# EAGLE schematic Goethe_RFID (EAGLE 7.7.0)
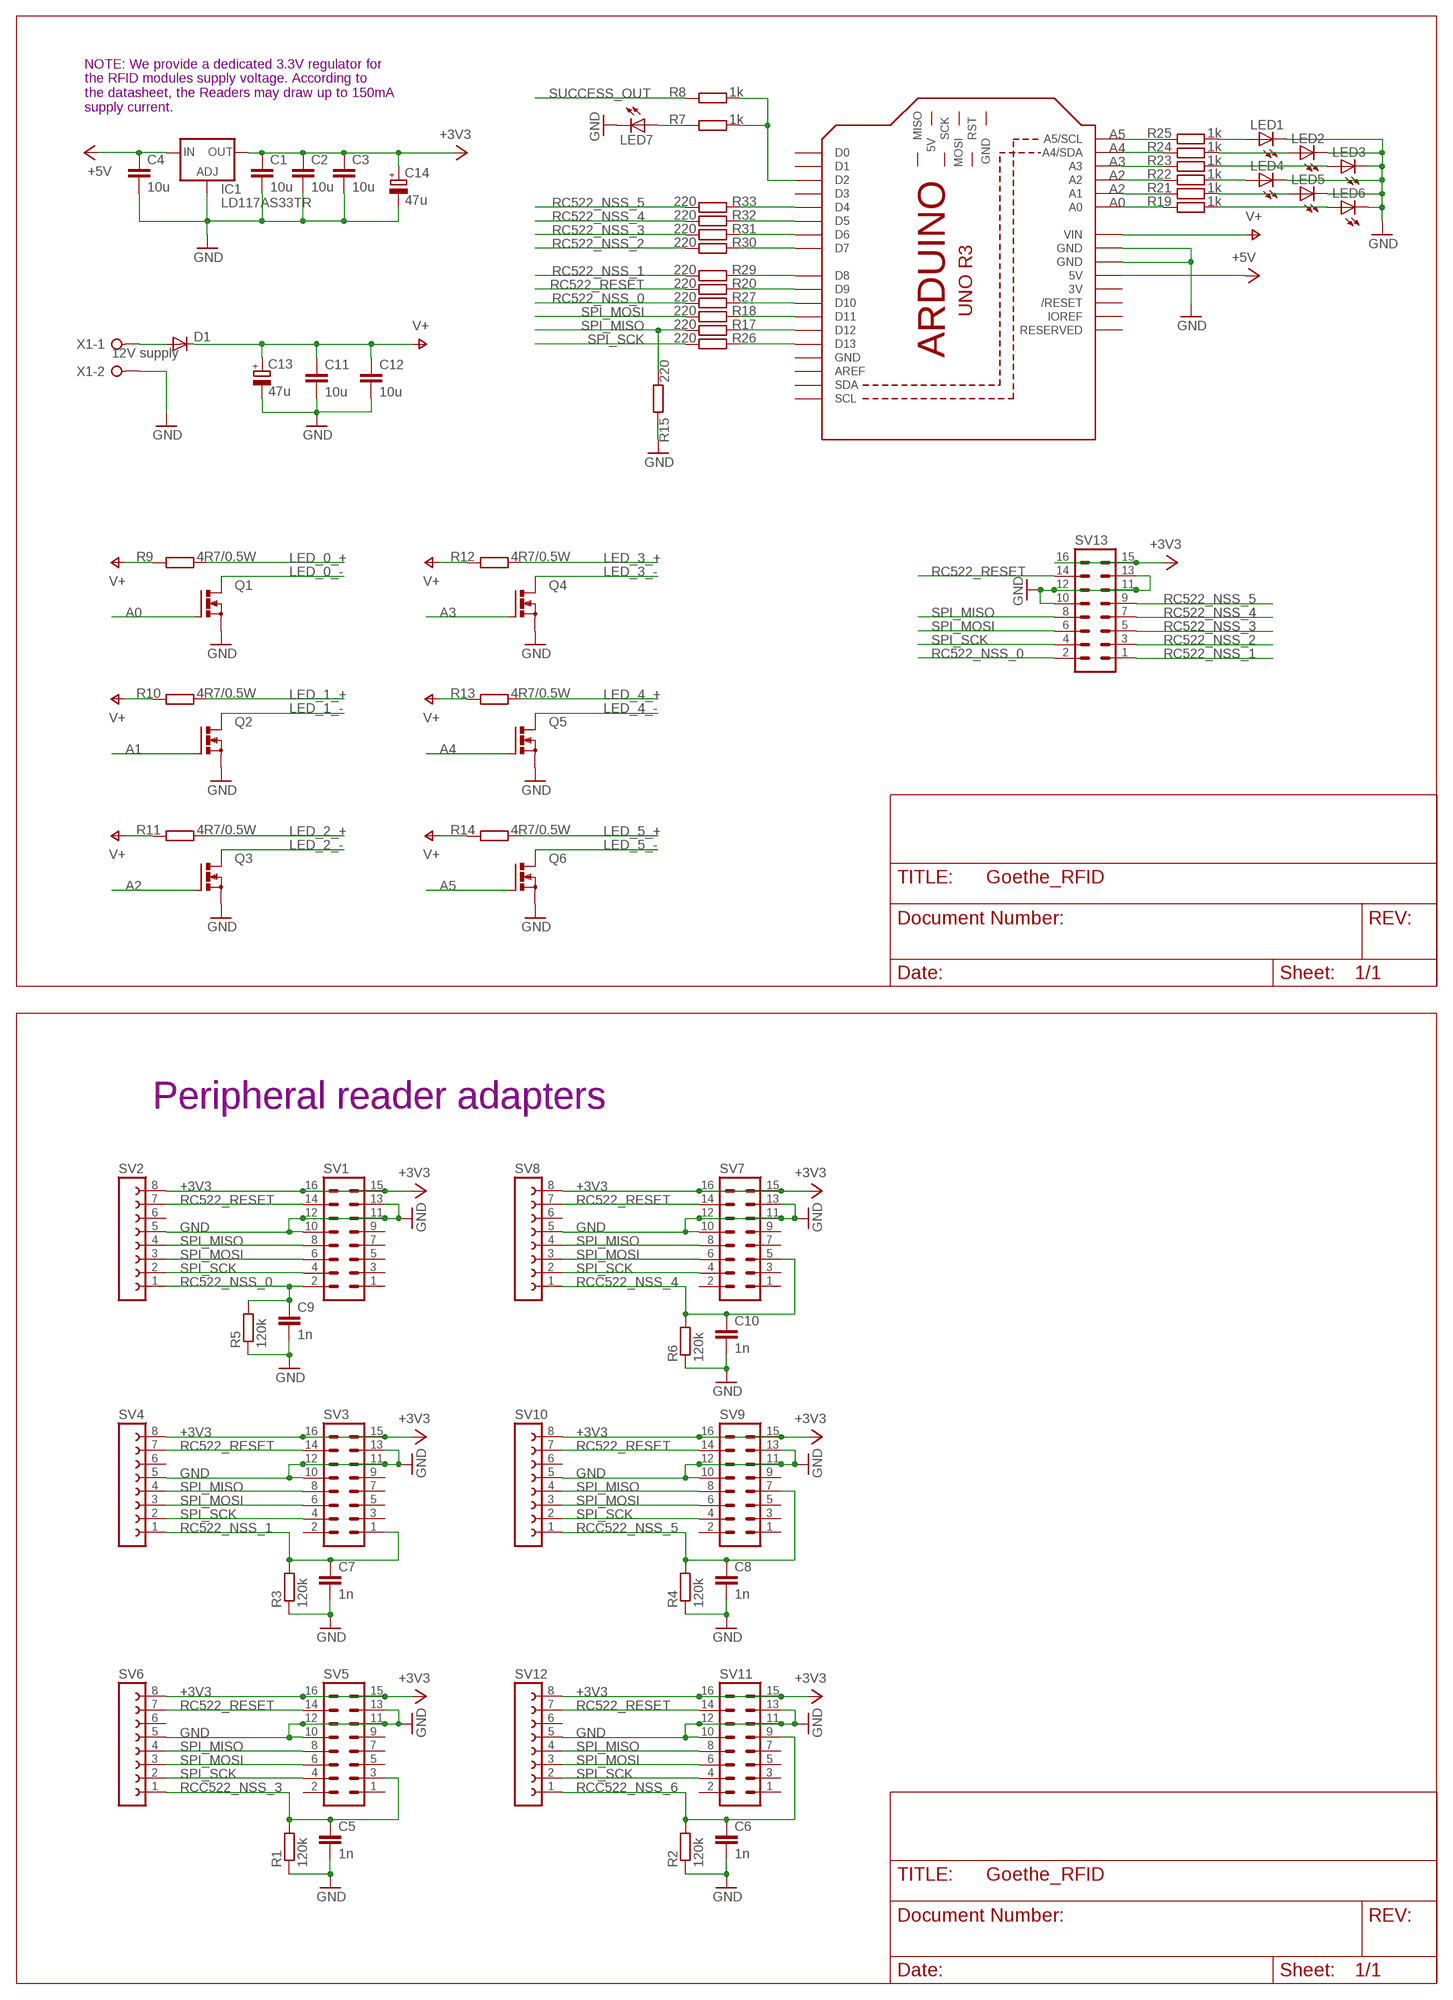
[diagram p0: schematic, sheet 1]

## Parts
C1  10u  C-EUC0805  [C0805]
C2  10u  C-EUC0805  [C0805]
C3  10u  C-EUC0805  [C0805]
C4  10u  C-EUC0805  [C0805]
C5  1n  C-EUC0805  [C0805]
C6  1n  C-EUC0805  [C0805]
C7  1n  C-EUC0805  [C0805]
C8  1n  C-EUC0805  [C0805]
C9  1n  C-EUC0805  [C0805]
C10  1n  C-EUC0805  [C0805]
C11  10u  C-EUC1206  [C1206]
C12  10u  C-EUC1206  [C1206]
C13  47u  CPOL-EUE15-6AXIAL  [E15-6]
C14  47u  CPOL-EUE15-6AXIAL  [E15-6]
D1  DIODE-SMB  [SMB]
IC1  LD117AS33TR  [SOT223]
LED1  LED3MM  [LED3MM]
LED2  LED3MM  [LED3MM]
LED3  LED3MM  [LED3MM]
LED4  LED3MM  [LED3MM]
LED5  LED3MM  [LED3MM]
LED6  LED3MM  [LED3MM]
LED7  LED3MM  [LED3MM]
M1  ARDUINO_R3_ICSP  [ARDUINOR3_ICSP]
Q1  PMOSFET_NTO220BV  [TO220BV]
Q2  PMOSFET_NTO220BV  [TO220BV]
Q3  PMOSFET_NTO220BV  [TO220BV]
Q4  PMOSFET_NTO220BV  [TO220BV]
Q5  PMOSFET_NTO220BV  [TO220BV]
Q6  PMOSFET_NTO220BV  [TO220BV]
R1  120k  R-EU_R0805  [R0805]
R2  120k  R-EU_R0805  [R0805]
R3  120k  R-EU_R0805  [R0805]
R4  120k  R-EU_R0805  [R0805]
R5  120k  R-EU_R0805  [R0805]
R6  120k  R-EU_R0805  [R0805]
R7  1k  R-EU_R0805  [R0805]
R8  1k  R-EU_R0805  [R0805]
R9  4R7/0.5W  R-EU_R0805  [R0805]
R10  4R7/0.5W  R-EU_R0805  [R0805]
R11  4R7/0.5W  R-EU_R0805  [R0805]
R12  4R7/0.5W  R-EU_R0805  [R0805]
R13  4R7/0.5W  R-EU_R0805  [R0805]
R14  4R7/0.5W  R-EU_R0805  [R0805]
R15  220  R-EU_R0805  [R0805]
R17  220  R-EU_R0805  [R0805]
R18  220  R-EU_R0805  [R0805]
R19  1k  R-EU_R0805  [R0805]
R20  220  R-EU_R0805  [R0805]
R21  1k  R-EU_R0805  [R0805]
R22  1k  R-EU_R0805  [R0805]
R23  1k  R-EU_R0805  [R0805]
R24  1k  R-EU_R0805  [R0805]
R25  1k  R-EU_R0805  [R0805]
R26  220  R-EU_R0805  [R0805]
R27  220  R-EU_R0805  [R0805]
R29  220  R-EU_R0805  [R0805]
R30  220  R-EU_R0805  [R0805]
R31  220  R-EU_R0805  [R0805]
R32  220  R-EU_R0805  [R0805]
R33  220  R-EU_R0805  [R0805]
SV1  ML16  [ML16]
SV2  FE08W  [FE08W]
SV3  ML16  [ML16]
SV4  FE08W  [FE08W]
SV5  ML16  [ML16]
SV6  FE08W  [FE08W]
SV7  ML16  [ML16]
SV8  FE08W  [FE08W]
SV9  ML16  [ML16]
SV10  FE08W  [FE08W]
SV11  ML16  [ML16]
SV12  FE08W  [FE08W]
SV13  ML16  [ML16]
X1  12V supply  W237-02P  [W237-132]

## Nets
+3V3: C1.1 C2.1 C3.1 C14.+ IC1.4(OUT) SV1.15 SV1.16 SV2.8 SV3.15 SV3.16 SV4.8 SV5.15 SV5.16 SV6.8 SV7.15 SV7.16 SV8.8 SV9.15 SV9.16 SV10.8 SV11.15 SV11.16 SV12.8 SV13.15 SV13.16
+5V: C4.1 IC1.3(IN) M1.5V
A0: M1.A0 Q1.G R19.2
A1: M1.A1 Q2.G R21.2
A2: M1.A2 Q3.G R22.2
A3: M1.A3 Q4.G R23.2
A4: M1.A4(A4/SDA) Q5.G R24.2
A5: M1.A5(A5/SCL) Q6.G R25.2
GND: C1.2 C2.2 C3.2 C4.2 C5.2 C6.2 C7.2 C8.2 C9.2 C10.2 C11.2 C12.2 C13.- C14.- IC1.1(ADJ) LED1.K(C) LED2.K(C) LED3.K(C) LED4.K(C) LED5.K(C) LED6.K(C) LED7.K(C) M1.GND@1(GND) M1.GND@3(GND) Q1.S Q2.S Q3.S Q4.S Q5.S Q6.S R1.1 R2.1 R3.1 R4.1 R5.1 R6.1 R15.2 SV1.10 SV1.11 SV1.12 SV1.13 SV2.5 SV3.10 SV3.11 SV3.12 SV3.13 SV4.5 SV5.10 SV5.11 SV5.12 SV5.13 SV6.5 SV7.10 SV7.11 SV7.12 SV7.13 SV8.5 SV9.10 SV9.11 SV9.12 SV9.13 SV10.5 SV11.10 SV11.11 SV11.12 SV11.13 SV12.5 SV13.10 SV13.11 SV13.12 SV13.13 X1.2
LED_0_+: R9.1
LED_0_-: Q1.D
LED_1_+: R10.1
LED_1_-: Q2.D
LED_2_+: R11.1
LED_2_-: Q3.D
LED_3_+: R12.1
LED_3_-: Q4.D
LED_4_+: R13.1
LED_4_-: Q5.D
LED_5_+: R14.1
LED_5_-: Q6.D
N$1: LED1.A R25.1
N$2: M1.D12 R17.2
N$3: LED4.A R22.1
N$4: LED2.A R24.1
N$5: LED3.A R23.1
N$6: LED5.A R21.1
N$7: M1.D2 R7.1 R8.1
N$8: LED7.A R7.2
N$9: D1.A X1.1
N$12: M1.D11 R18.2
N$14: M1.D9 R20.2
N$21: M1.D10 R27.2
N$22: LED6.A R19.1
N$23: M1.D8 R29.2
N$24: M1.D7 R30.2
N$25: M1.D6 R31.2
N$26: M1.D5 R32.2
N$27: M1.D4 R33.2
RC522_NSS_0: C9.1 R5.2 R27.1 SV1.2 SV2.1 SV13.2
RC522_NSS_1: C7.1 R3.2 R29.1 SV3.1 SV4.1 SV13.1
RC522_NSS_2: R30.1 SV13.3
RC522_NSS_3: R31.1 SV13.5
RC522_NSS_4: R32.1 SV13.7
RC522_NSS_5: R33.1 SV13.9
RC522_RESET: R20.1 SV1.14 SV2.7 SV3.14 SV4.7 SV5.14 SV6.7 SV7.14 SV8.7 SV9.14 SV10.7 SV11.14 SV12.7 SV13.14
RCC522_NSS_3: C5.1 R1.2 SV5.3 SV6.1
RCC522_NSS_4: C10.1 R6.2 SV7.5 SV8.1
RCC522_NSS_5: C8.1 R4.2 SV9.7 SV10.1
RCC522_NSS_6: C6.1 R2.2 SV11.9 SV12.1
SPI_MISO: R15.1 R17.1 SV1.8 SV2.4 SV3.8 SV4.4 SV5.8 SV6.4 SV7.8 SV8.4 SV9.8 SV10.4 SV11.8 SV12.4 SV13.8
SPI_MOSI: R18.1 SV1.6 SV2.3 SV3.6 SV4.3 SV5.6 SV6.3 SV7.6 SV8.3 SV9.6 SV10.3 SV11.6 SV12.3 SV13.6
SPI_SCK: M1.D13 R26.1 R26.2 SV1.4 SV2.2 SV3.4 SV4.2 SV5.4 SV6.2 SV7.4 SV8.2 SV9.4 SV10.2 SV11.4 SV12.2 SV13.4
SUCCESS_OUT: R8.2
V+: C11.1 C12.1 C13.+ D1.C M1.VIN R9.2 R10.2 R11.2 R12.2 R13.2 R14.2
Unconnected: M1.5V_ICSP(5V) M1.AREF M1.D0 M1.D1 M1.D3 M1.GND@2(GND) M1.IOREF M1.MISO M1.MOSI M1.RESERVED M1.RESET(/RESET) M1.RESET_ICSP(RST) M1.SCK M1.SCL M1.SDA SV1.1 SV1.3 SV1.5 SV1.7 SV1.9 SV2.6 SV3.2 SV3.3 SV3.5 SV3.7 SV3.9 SV4.6 SV5.1 SV5.2 SV5.5 SV5.7 SV5.9 SV6.6 SV7.1 SV7.2 SV7.3 SV7.7 SV7.9 SV8.6 SV9.1 SV9.2 SV9.3 SV9.5 SV9.9 SV10.6 SV11.1 SV11.2 SV11.3 SV11.5 SV11.7 SV12.6

## Notes on the sheet
- NOTE: We provide a dedicated 3.3V regulator for
  the RFID modules supply voltage. According to
  the datasheet, the Readers may draw up to 150mA
  supply current.
- Peripheral reader adapters

## Power pins joined to a net without a drawn wire
3V: M1.3V
GND: M1.GND

## Library data of the parts
C1-C12 = rcl:C-EU: CAPACITOR, European symbol
C13 C14 = rcl:CPOL-EU: POLARIZED CAPACITOR, European symbol
D1 = diode:DIODE-: DIODE
IC1 = v-reg:LD117A?*: Low drop fixed and adjustable positive voltage regulators 1 A Source: http://www.st.com/stonline/products/literature/ds/7194/ld1117axx.pdf
LED1-LED7 = led:LED: LED OSRAM: - CHIPLED LG R971, LG N971, LY N971, LG Q971, LY Q971, LO R971, LY R971 LH N974, LH R974 LS Q976, LO Q976, LY Q976 LO Q996 - Hyper CHIPLED LW Q18S LB Q993, LB Q99A, LB R99A - SideLED LS A670, LO A670, LY A670, LG A670, LP A670 LB A673, LV A673, LT A673, LW A673 LH A674 LY A675 LS A676, LA A676, LO A676, LY A676, LW A676 LS A679, LY A679, LG A679 - Hyper Micro SIDELED® LS Y876, LA Y876, LO Y876, LY Y876 LT Y87S - SmartLED LW L88C, LW L88S LB L89C, LB L89S, LG L890 LS L89K, LO L89K, LY L89K LS L896, LA L896, LO L896, LY L896 - TOPLED LS T670, LO T670, LY T670, LG T670, LP T670 LSG T670, LSP T670, LSY T670, LOP T670, LYG T670 LG T671, LOG T671, LSG T671 LB T673, LV T673, LT T673, LW T673 LH T674 LS T676, LA T676, LO T676, LY T676, LB T676, LH T676, LSB T676, LW T676 LB T67C, LV T67C, LT T67C, LS T67K, LO T67K, LY T67K, LW E67C LS E67B, LA E67B, LO E67B, LY E67B, LB E67C, LV E67C, LT E67C LW T67C LS T679, LY T679, LG T679 LS T770, LO T770, LY T770, LG T770, LP T770 LB T773, LV T773, LT T773, LW T773 LH T774 LS E675, LA E675, LY E675, LS T675 LS T776, LA T776, LO T776, LY T776, LB T776 LHGB T686 LT T68C, LB T68C - Hyper Mini TOPLED® LB M676 - Mini TOPLED Santana® LG M470 LS M47K, LO M47K, LY M47K Source: http://www.osram.convergy.de LUXEON: - LUMILED® LXK2-PW12-R00, LXK2-PW12-S00, LXK2-PW14-U00, LXK2-PW14-V00 LXK2-PM12-R00, LXK2-PM12-S00, LXK2-PM14-U00 LXK2-PE12-Q00, LXK2-PE12-R00, LXK2-PE12-S00, LXK2-PE14-T00, LXK2-PE14-U00 LXK2-PB12-K00, LXK2-PB12-L00, LXK2-PB12-M00, LXK2-PB14-N00, LXK2-PB14-P00, LXK2-PB14-Q00 LXK2-PR12-L00, LXK2-PR12-M00, LXK2-PR14-Q00, LXK2-PR14-R00 LXK2-PD12-Q00, LXK2-PD12-R00, LXK2-PD12-S00 LXK2-PH12-R00, LXK2-PH12-S00 LXK2-PL12-P00, LXK2-PL12-Q00, LXK2-PL12-R00 Source: www.luxeon.com KINGBRIGHT: KA-3528ASYC Source: www.kingbright.com
M1 = adafruit:ARDUINO_R3_ICSP
Q1-Q6 = transistor-power:PMOSFET_N: Power MOSFET N-Channel
R1-R15 R17-R27 R29-R33 = rcl:R-EU_: RESISTOR, European symbol
SV1 SV3 SV5 SV7 SV9 SV11 SV13 = con-harting-ml:ML16: HARTING; OC_FARNELL: unknown; OC_NEWARK: unknown
SV2 SV4 SV6 SV8 SV10 SV12 = con-lsta:FE08W: FEMALE HEADER; OC_FARNELL: unknown; OC_NEWARK: unknown
X1 = con-wago-508:W237-02P: WAGO SREW CLAMP; OC_FARNELL: unknown; OC_NEWARK: unknown